# Altium project PCB_Project1.PrjPCB
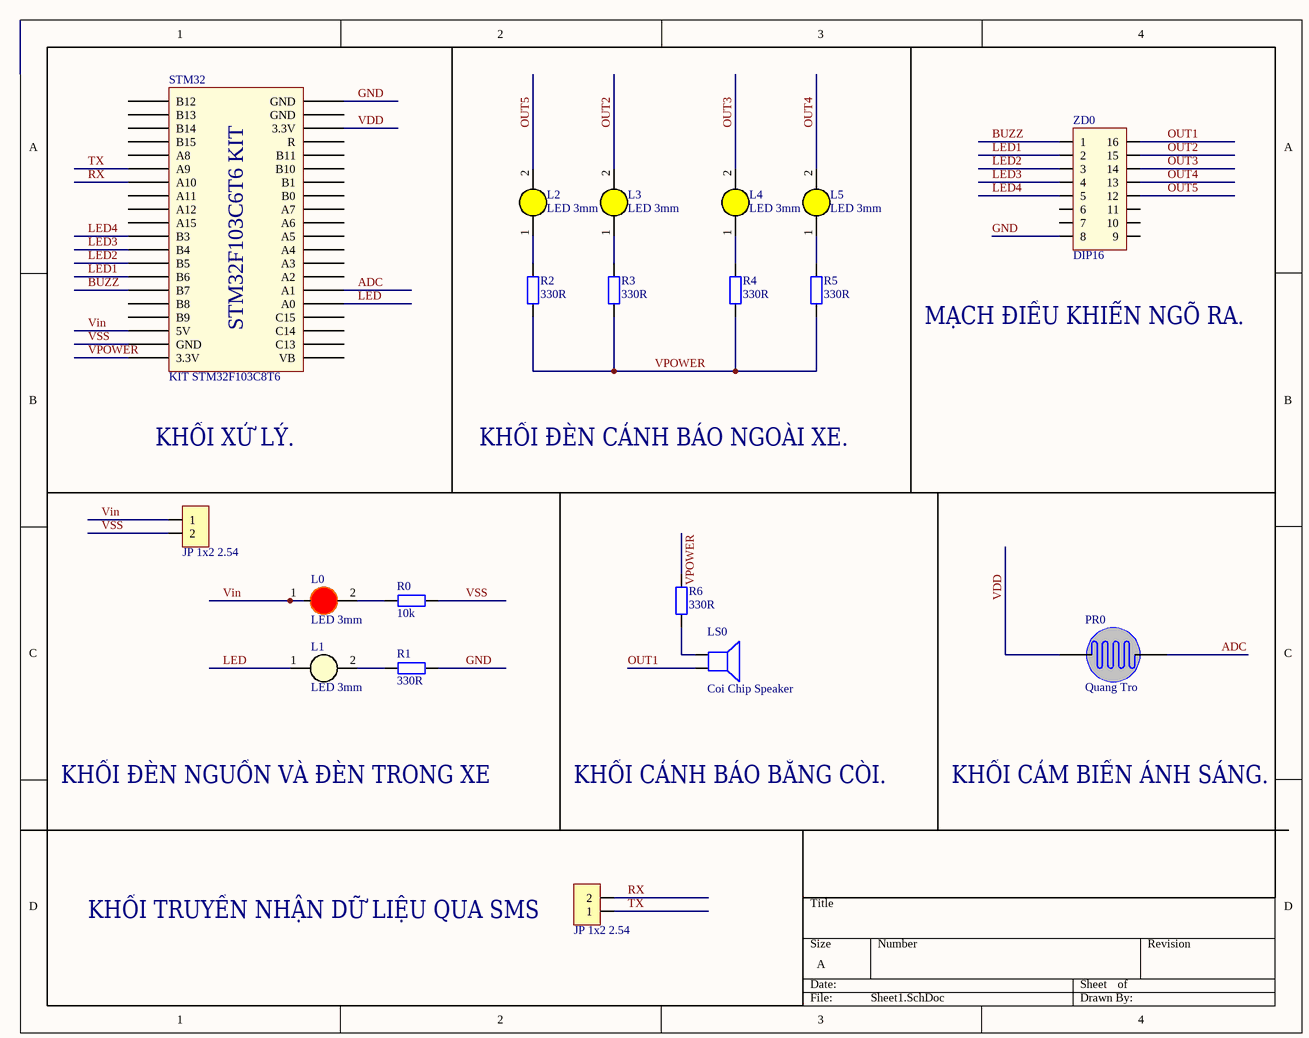
[diagram p0: Sheet1.SchDoc]
1 sheet, 19 parts. Net scope: global (net labels, ports and power ports of the same name join across sheets).
Board file: project.PcbDoc

## Sheet Sheet1.SchDoc
size A

### Parts
JP1  JP 1x2 2.54  [JP 1x2 DT]
JP2  JP 1x2 2.54  [JP 1x2 CT]
L0  LED 3mm  [LED-3MM-RED]
L1  LED 3mm  [LED-3MM-WHITE]
L2  LED 3mm  [LED-3MM-YELLOW]
L3  LED 3mm  [LED-3MM-YELLOW]
L4  LED 3mm  [LED-3MM-YELLOW]
L5  LED 3mm  [LED-3MM-YELLOW]
LS0  Coi Chip Speaker  [Coi Chip Speacker]
PR0  Quang Tro  [Quang Tro]
R0  10k  [tro vach 1/4w]
R1  330R  [tro vach 1/4w]
R2  330R  [tro vach 1/4w]
R3  330R  [tro vach 1/4w]
R4  330R  [tro vach 1/4w]
R5  330R  [tro vach 1/4w]
R6  330R  [tro vach 1/4w]
STM32  KIT STM32F103C8T6  [STM32F103 KIT]
ZD0  DIP16  [DIP16/W0.3]

### Nets
ADC: PR0.2 STM32.26(A1)
BUZZ: STM32.15(B7) ZD0.1
GND: R1.1 STM32.40(GND) ZD0.8
LED: L1.1(A) STM32.25(A0)
LED1: STM32.14(B6) ZD0.2
LED2: STM32.13(B5) ZD0.3
LED3: STM32.12(B4) ZD0.4
LED4: STM32.11(B3) ZD0.5
OUT1: LS0.2 ZD0.16
OUT2: L3.2(K) ZD0.15
OUT3: L4.2(K) ZD0.14
OUT4: L5.2(K) ZD0.13
OUT5: L2.2(K) ZD0.12
RX: JP2.2 STM32.7(A10)
TX: JP2.1 STM32.6(A9)
VDD: PR0.1 STM32.38(3.3V)
Vin: JP1.1 L0.1(A) STM32.18(5V)
VPOWER: R2.1 R3.1 R4.1 R5.1 R6.2 STM32.20(3.3V)
VSS: JP1.2 R0.2 STM32.19(GND)
NetL0_2: L0.2(K) R0.1
NetL1_2: L1.2(K) R1.2
NetL2_1: L2.1(A) R2.2
NetL3_1: L3.1(A) R3.2
NetL4_1: L4.1(A) R4.2
NetL5_1: L5.1(A) R5.2
NetLS0_1: LS0.1 R6.1

Not connected (* = marked no-connect by the designer): STM32 1(B12) 2(B13) 3(B14) 4(B15) 5(A8) 8(A11) 9(A12) 10(A15) 16(B8) 17(B9) 21(VB) 22(C13) 23(C14) 24(C15) 27(A2) 28(A3) 29(A4) 30(A5) 31(A6) 32(A7) 33(B0) 34(B1) 35(B10) 36(B11) 37(R) 39(GND); ZD0 6 7 9 10 11

### Notes on the sheet
- MẠCH ĐIỀU KHIỂN NGÕ RA.
- KHỐI XỬ LÝ.
- KHỐI ĐÈN CẢNH BÁO NGOÀI XE.
- KHỐI ĐÈN NGUỒN VÀ ĐÈN TRONG XE
- KHỐI CẢNH BÁO BẰNG CÒI.
- KHỐI CẢM BIẾN ÁNH SÁNG.
- KHỐI TRUYỀN NHẬN DỮ LIỆU QUA SMS
- (in symbol STM32f103 Bluepill) STM32F103C6T6 KIT

### Library data of the parts
JP1 = JP 1x2 2.54 Duc Thang: Cắm; Ten_Linh_Kien: Jump Đơn Đực 2.54MM 1x40P Thẳng 11MM; Don_Vi: Con; Ma_Hang: MH000903; Ghi_Chu: *; Kieu_Chan: *; Chung_Loai: Cắm
JP2 = JP 1x2 2.54 Cai Thang: Cắm; Ten_Linh_Kien: Jump Đơn Cái 2.54MM 1x20P Thẳng; Don_Vi: Con; Ma_Hang: MH004006; Ghi_Chu: *; Kieu_Chan: *; Chung_Loai: Cắm
L0 = LED 3mm Do: Cắm; Don_Vi: Con; Ma_Hang: MH003892; Ten_Linh_Kien: Led 3MM Phủ Đỏ (10c); Ghi_Chu: *; Kieu_Chan: *; Chung_Loai: Cắm
L1 = LED 3mm Trang: Cắm; Don_Vi: Con; Ma_Hang: MH009001; Ten_Linh_Kien: LED 3MM Trắng SS (1000c); Ghi_Chu: *; Kieu_Chan: *; Chung_Loai: Cắm
L2-L5 = LED 3mm Vang: Cắm; Don_Vi: Con; Ma_Hang: MH003893; Ten_Linh_Kien: Led 3MM Phủ Vàng (10c); Ghi_Chu: *; Kieu_Chan: *; Chung_Loai: Cắm
LS0 = Coi Chip Speaker: Còi chip
PR0 = Quang Tro: Photoresistor; Creator: Bien Nguyen
R0 = Tro Vach 1/4W 5% 10k: Căm; Chung_Loai: Cắm; Don_Vi: Con; So_Chan: 2; Ten_Linh_Kien: Trở Vạch 1/4w 5% 10K; Ma_Hang: MH007354; Kieu_Chan: *
R1-R6 = Tro Vach 1/4W 5% 330R: Cắm; Don_Vi: Con; So_Chan: 2; Ten_Linh_Kien: Trở Vạch 1/4W 5% 330R; Ma_Hang: MH007436; Chung_Loai: Cắm; Kieu_Chan: *
STM32 = STM32f103 Bluepill: KIT STM32F103C8T6 Bluepill
ZD0 = DIP16: Value: DIP16